# Altium schematic sheet Peripheral.SchDoc
size 381 x 241 mm; SheetNumber: 1; SheetTotal: 3
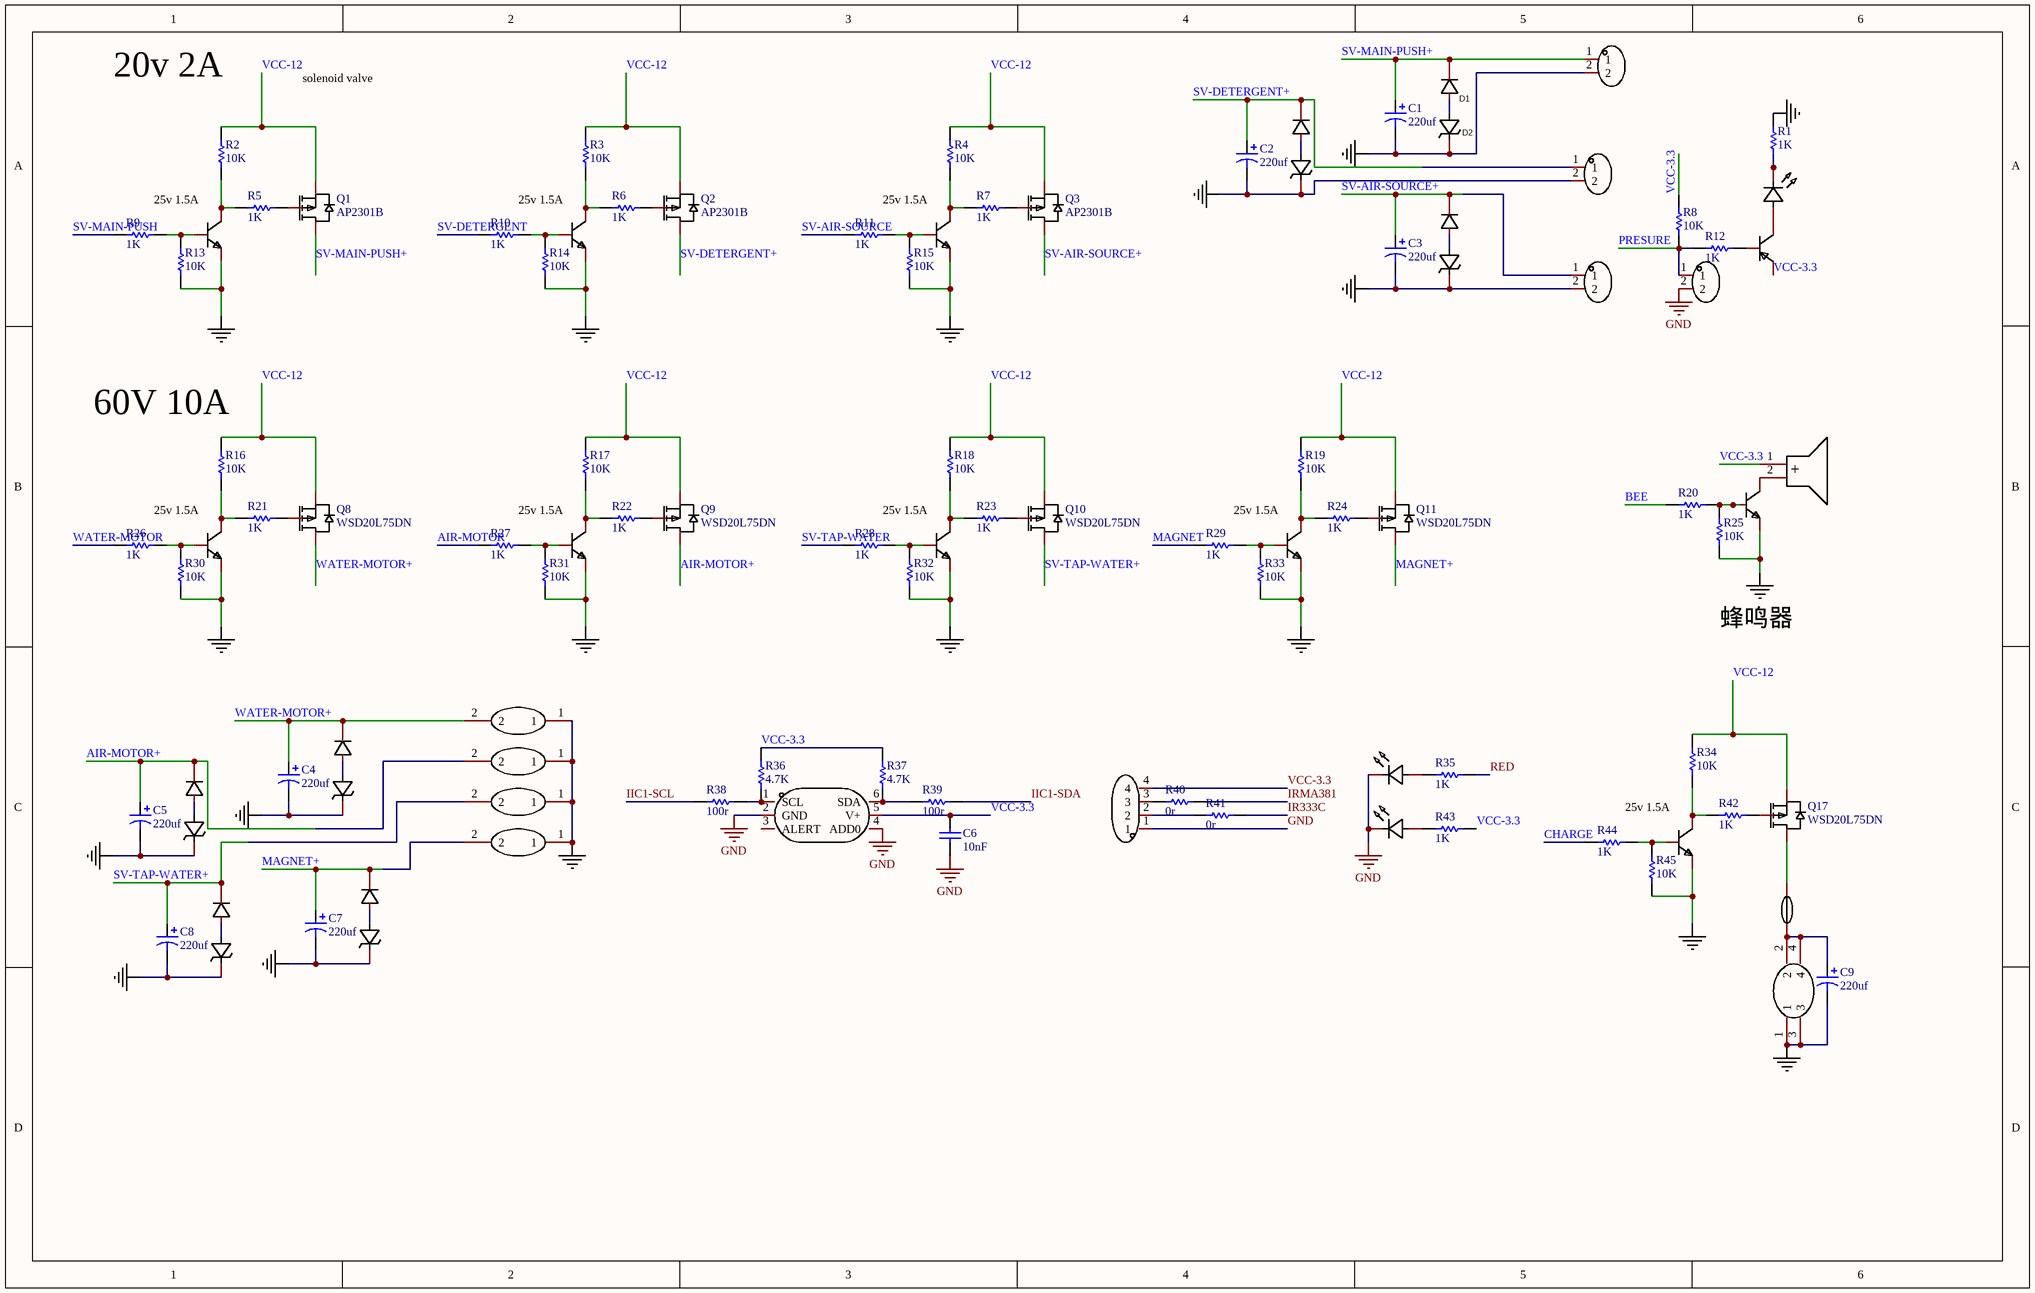
[diagram p0: Peripheral.SchDoc]

## Parts
B1  HNB09A03  [BUZ-TH_BD9.0-P5.00-D0.6-FD]  (value not drawn)
C1  value 220uf  [CAP-SMD_BD6.3-L6.6-W6.6-LS7.4-FD]  (hidden comment: RVT1E221M0607)
C2  value 220uf  [CAP-SMD_BD6.3-L6.6-W6.6-LS7.4-FD]  (hidden comment: RVT1E221M0607)
C3  value 220uf  [CAP-SMD_BD6.3-L6.6-W6.6-LS7.4-FD]  (hidden comment: RVT1E221M0607)
C4  value 220uf  [CAP-SMD_BD6.3-L6.6-W6.6-LS7.4-FD]  (hidden comment: RVT1E221M0607)
C5  value 220uf  [CAP-SMD_BD6.3-L6.6-W6.6-LS7.4-FD]  (hidden comment: RVT1E221M0607)
C6  value 10nF  [C0402]  (hidden comment: CL05B103KB5NNNC)
C7  value 220uf  [CAP-SMD_BD6.3-L6.6-W6.6-LS7.4-FD]  (hidden comment: RVT1E221M0607)
C8  value 220uf  [CAP-SMD_BD6.3-L6.6-W6.6-LS7.4-FD]  (hidden comment: RVT1E221M0607)
C9  value 220uf  [CAP-SMD_BD6.3-L6.6-W6.6-LS7.4-FD]  (hidden comment: RVT1E221M0607)
D1  SM4007PL  [SOD-123F_L2.8-W1.8-LS3.7-RD]  (value not drawn)
D2  BZT52C18W  [SOD-123_L2.7-W1.6-LS3.8-RD]  (value not drawn)
D3  SM4007PL  [SOD-123F_L2.8-W1.8-LS3.7-RD]  (value not drawn)
D4  BZT52C18W  [SOD-123_L2.7-W1.6-LS3.8-RD]  (value not drawn)
D5  SM4007PL  [SOD-123F_L2.8-W1.8-LS3.7-RD]  (value not drawn)
D6  BZT52C18W  [SOD-123_L2.7-W1.6-LS3.8-RD]  (value not drawn)
D7  SM4007PL  [SOD-123F_L2.8-W1.8-LS3.7-RD]  (value not drawn)
D8  BZT52C18W  [SOD-123_L2.7-W1.6-LS3.8-RD]  (value not drawn)
D9  KT-0603R  [LED0603-RD_RED]  (value not drawn)
D10  SM4007PL  [SOD-123F_L2.8-W1.8-LS3.7-RD]  (value not drawn)
D11  BZT52C18W  [SOD-123_L2.7-W1.6-LS3.8-RD]  (value not drawn)
D12  KT-0603W  [LED0603-RD_RED]  (value not drawn)
D13  SM4007PL  [SOD-123F_L2.8-W1.8-LS3.7-RD]  (value not drawn)
D14  SM4007PL  [SOD-123F_L2.8-W1.8-LS3.7-RD]  (value not drawn)
D15  BZT52C18W  [SOD-123_L2.7-W1.6-LS3.8-RD]  (value not drawn)
D16  BZT52C18W  [SOD-123_L2.7-W1.6-LS3.8-RD]  (value not drawn)
F1  BSMD2920-600-16V  [F2920]  (value not drawn)
LED1  19-213/Y2C-CQ2R2L/3T(CY)  [LED0603-RD_RED]  (value not drawn)
P1  ZX-HY2.0-2PZZ  [CONN-TH_2P-P2.00_ZX-HY2.0-2PZZ]  (value not drawn)
P2  ZX-HY2.0-2PZZ  [CONN-TH_2P-P2.00_ZX-HY2.0-2PZZ]  (value not drawn)
P3  ZX-HY2.0-2PZZ  [CONN-TH_2P-P2.00_ZX-HY2.0-2PZZ]  (value not drawn)
P4  ZX-HY2.0-2PZZ  [CONN-TH_2P-P2.00_ZX-HY2.0-2PZZ]  (value not drawn)
P5  HC-5557-2*1A  [CONN-TH_HAA420A-2A]  (value not drawn)
P6  HC-5557-2*1A  [CONN-TH_HAA420A-2A]  (value not drawn)
P7  HC-5557-2*1A  [CONN-TH_HAA420A-2A]  (value not drawn)
P8  ZX-HY2.0-4PZZ  [CONN-TH_4P-P2.00_HX20020-4A_2]  (value not drawn)
P9  HC-5557-2*1A  [CONN-TH_HAA420A-2A]  (value not drawn)
P10  HC-5557-2*2A  [CONN-TH_HAA420A-4A]  (value not drawn)
Q1  AP2301B  [SOT-23-3_L2.9-W1.3-P1.90-LS2.4-TR]
Q2  AP2301B  [SOT-23-3_L2.9-W1.3-P1.90-LS2.4-TR]
Q3  AP2301B  [SOT-23-3_L2.9-W1.3-P1.90-LS2.4-TR]
Q4  SS8050(RANGE:200-350)  [SOT-23_L2.9-W1.3-P1.90-LS2.4-BR]  (value not drawn)
Q5  SS8050(RANGE:200-350)  [SOT-23_L2.9-W1.3-P1.90-LS2.4-BR]  (value not drawn)
Q6  SS8050(RANGE:200-350)  [SOT-23_L2.9-W1.3-P1.90-LS2.4-BR]  (value not drawn)
Q7  SS8550 Y2(RANGE:200-350)  [SOT-23_L2.9-W1.3-P1.90-LS2.4-BR]  (value not drawn)
Q8  WSD20L75DN  [DFN-8_L3.3-W3.3-P0.65-BL_WSD20L75DN]
Q9  WSD20L75DN  [DFN-8_L3.3-W3.3-P0.65-BL_WSD20L75DN]
Q10  WSD20L75DN  [DFN-8_L3.3-W3.3-P0.65-BL_WSD20L75DN]
Q11  WSD20L75DN  [DFN-8_L3.3-W3.3-P0.65-BL_WSD20L75DN]
Q12  SS8050(RANGE:200-350)  [SOT-23_L2.9-W1.3-P1.90-LS2.4-BR]  (value not drawn)
Q13  SS8050(RANGE:200-350)  [SOT-23_L2.9-W1.3-P1.90-LS2.4-BR]  (value not drawn)
Q14  SS8050(RANGE:200-350)  [SOT-23_L2.9-W1.3-P1.90-LS2.4-BR]  (value not drawn)
Q15  SS8050(RANGE:200-350)  [SOT-23_L2.9-W1.3-P1.90-LS2.4-BR]  (value not drawn)
Q16  SS8050(RANGE:200-350)  [SOT-23_L2.9-W1.3-P1.90-LS2.4-BR]  (value not drawn)
Q17  WSD20L75DN  [DFN-8_L3.3-W3.3-P0.65-BL_WSD20L75DN]
Q18  SS8050(RANGE:200-350)  [SOT-23_L2.9-W1.3-P1.90-LS2.4-BR]  (value not drawn)
R1  value 1K  [R0402]  (hidden comment: 0402WGF1001TCE)
R2  value 10K  [R0402]  (hidden comment: 0402WGF1002TCE)
R3  value 10K  [R0402]  (hidden comment: 0402WGF1002TCE)
R4  value 10K  [R0402]  (hidden comment: 0402WGF1002TCE)
R5  value 1K  [R0402]  (hidden comment: 0402WGF1001TCE)
R6  value 1K  [R0402]  (hidden comment: 0402WGF1001TCE)
R7  value 1K  [R0402]  (hidden comment: 0402WGF1001TCE)
R8  value 10K  [R0402]  (hidden comment: 0402WGF1002TCE)
R9  value 1K  [R0402]  (hidden comment: 0402WGF1001TCE)
R10  value 1K  [R0402]  (hidden comment: 0402WGF1001TCE)
R11  value 1K  [R0402]  (hidden comment: 0402WGF1001TCE)
R12  value 1K  [R0402]  (hidden comment: 0402WGF1001TCE)
R13  value 10K  [R0402]  (hidden comment: 0402WGF1002TCE)
R14  value 10K  [R0402]  (hidden comment: 0402WGF1002TCE)
R15  value 10K  [R0402]  (hidden comment: 0402WGF1002TCE)
R16  value 10K  [R0402]  (hidden comment: 0402WGF1002TCE)
R17  value 10K  [R0402]  (hidden comment: 0402WGF1002TCE)
R18  value 10K  [R0402]  (hidden comment: 0402WGF1002TCE)
R19  value 10K  [R0402]  (hidden comment: 0402WGF1002TCE)
R20  value 1K  [R0402]  (hidden comment: 0402WGF1001TCE)
R21  value 1K  [R0402]  (hidden comment: 0402WGF1001TCE)
R22  value 1K  [R0402]  (hidden comment: 0402WGF1001TCE)
R23  value 1K  [R0402]  (hidden comment: 0402WGF1001TCE)
R24  value 1K  [R0402]  (hidden comment: 0402WGF1001TCE)
R25  value 10K  [R0402]  (hidden comment: 0402WGF1002TCE)
R26  value 1K  [R0402]  (hidden comment: 0402WGF1001TCE)
R27  value 1K  [R0402]  (hidden comment: 0402WGF1001TCE)
R28  value 1K  [R0402]  (hidden comment: 0402WGF1001TCE)
R29  value 1K  [R0402]  (hidden comment: 0402WGF1001TCE)
R30  value 10K  [R0402]  (hidden comment: 0402WGF1002TCE)
R31  value 10K  [R0402]  (hidden comment: 0402WGF1002TCE)
R32  value 10K  [R0402]  (hidden comment: 0402WGF1002TCE)
R33  value 10K  [R0402]  (hidden comment: 0402WGF1002TCE)
R34  value 10K  [R0402]  (hidden comment: 0402WGF1002TCE)
R35  value 1K  [R0402]  (hidden comment: 0402WGF1001TCE)
R36  value 4.7K  [R0402]  (hidden comment: 0402WGF4701TCE)
R37  value 4.7K  [R0402]  (hidden comment: 0402WGF4701TCE)
R38  value 100r  [R0402]  (hidden comment: 0402WGF1000TCE)
R39  value 100r  [R0402]  (hidden comment: 0402WGF1000TCE)
R40  value 0r  [R0402]  (hidden comment: 0402WGF0000TCE)
R41  value 0r  [R0402]  (hidden comment: 0402WGF0000TCE)
R42  value 1K  [R0402]  (hidden comment: 0402WGF1001TCE)
R43  value 1K  [R0402]  (hidden comment: 0402WGF1001TCE)
R44  value 1K  [R0402]  (hidden comment: 0402WGF1001TCE)
R45  value 10K  [R0402]  (hidden comment: 0402WGF1002TCE)
U1  TMP112AIDRLR  [SOT-563_L1.6-W1.2-P0.50-LS1.6-BR]  (value not drawn)

## Nets
GND: C1.2 C2.2 C3.2 C4.2 C5.2 C6.2 C7.2 C8.2 C9.2 D2.1(C) D4.1(C) D6.1(C) D8.1(C) D9.1(K) D11.1(C) D12.1(K) D15.1(C) D16.1(C) P1.2 P2.2 P3.2 P4.2 P5.1 P6.1 P7.1 P8.1 P9.1 P10.1 P10.3 Q4.2 Q5.2 Q6.2 Q12.2 Q13.2 Q14.2 Q15.2 Q16.2 Q18.2 R1.2 R13.1 R14.1 R15.1 R25.1 R30.1 R31.1 R32.1 R33.1 R45.1 U1.2(GND) U1.4(ADD0)
AIR-MOTOR: R27.1
AIR-MOTOR+: C5.1 D10.1(C) P6.2 Q9.3(D)
BEE: R20.1
CHARGE: R44.1
IIC1-SCL: R38.1
IIC1-SDA: R39.2
IR333C: R41.2
IRMA381: R40.2
MAGNET: R29.1
MAGNET+: C7.1 D13.1(C) P9.2 Q11.3(D)
PRESURE: P4.1 R8.1 R12.2
RED: R35.2
SV-AIR-SOURCE: R11.1
SV-AIR-SOURCE+: C3.1 D5.1(C) P3.1 Q3.3(D)
SV-DETERGENT: R10.1
SV-DETERGENT+: C2.1 D3.1(C) P2.1 Q2.3(D)
SV-MAIN-PUSH: R9.1
SV-MAIN-PUSH+: C1.1 D1.1(C) P1.1 Q1.3(D)
SV-TAP-WATER: R28.1
SV-TAP-WATER+: C8.1 D14.1(C) P7.2 Q10.3(D)
VCC-3.3: B1.1(+) C6.1 P8.4 Q7.2(E) R8.2 R36.2 R37.2 R43.2 U1.5(V+)
VCC-12: Q1.1(S) Q2.1(S) Q3.1(S) Q8.1(S) Q9.1(S) Q10.1(S) Q11.1(S) Q17.1(S) R2.2 R3.2 R4.2 R16.2 R17.2 R18.2 R19.2 R34.2
WATER-MOTOR: R26.1
WATER-MOTOR+: C4.1 D7.1(C) P5.2 Q8.3(D)
NetB1_2: B1.2(-) Q12.3
NetC9_1: C9.1 F1.1 P10.2 P10.4
NetD1_2: D1.2(A) D2.2(A)
NetD3_2: D3.2(A) D4.2(A)
NetD5_2: D5.2(A) D6.2(A)
NetD7_2: D7.2(A) D8.2(A)
NetD9_2: D9.2(A) R35.1
NetD10_2: D10.2(A) D11.2(A)
NetD12_2: D12.2(A) R43.1
NetD13_2: D13.2(A) D15.2(A)
NetD14_2: D14.2(A) D16.2(A)
NetF1_2: F1.2 Q17.3(D)
NetLED1_1: LED1.1(K) R1.1
NetLED1_2: LED1.2(A) Q7.3(C)
NetP8_2: P8.2 R41.1
NetP8_3: P8.3 R40.1
NetQ1_2: Q1.2(G) R5.2
NetQ2_2: Q2.2(G) R6.2
NetQ3_2: Q3.2(G) R7.2
NetQ4_1: Q4.1 R9.2 R13.2
NetQ4_3: Q4.3 R2.1 R5.1
NetQ5_1: Q5.1 R10.2 R14.2
NetQ5_3: Q5.3 R3.1 R6.1
NetQ6_1: Q6.1 R11.2 R15.2
NetQ6_3: Q6.3 R4.1 R7.1
NetQ7_1: Q7.1(B) R12.1
NetQ8_2: Q8.2(G) R21.2
NetQ9_2: Q9.2(G) R22.2
NetQ10_2: Q10.2(G) R23.2
NetQ11_2: Q11.2(G) R24.2
NetQ12_1: Q12.1 R20.2 R25.2
NetQ13_1: Q13.1 R26.2 R30.2
NetQ13_3: Q13.3 R16.1 R21.1
NetQ14_1: Q14.1 R27.2 R31.2
NetQ14_3: Q14.3 R17.1 R22.1
NetQ15_1: Q15.1 R28.2 R32.2
NetQ15_3: Q15.3 R18.1 R23.1
NetQ16_1: Q16.1 R29.2 R33.2
NetQ16_3: Q16.3 R19.1 R24.1
NetQ17_2: Q17.2(G) R42.2
NetQ18_1: Q18.1 R44.2 R45.2
NetQ18_3: Q18.3 R34.1 R42.1
NetR36_1: R36.1 R38.2 U1.1(SCL)
NetR37_1: R37.1 R39.1 U1.6(SDA)

Not connected (* = marked no-connect by the designer): U1 3(ALERT)

## Notes on the sheet
- 20v 2A
- solenoid valve
- (near Q4) 25v 1.5A
- (near Q5) 25v 1.5A
- (near Q6) 25v 1.5A
- (near R16) 60V 10A
- (near Q13) 25v 1.5A
- (near Q14) 25v 1.5A
- (near Q15) 25v 1.5A
- (near Q16) 25v 1.5A
- 蜂鸣器
- (near Q18) 25v 1.5A

## Library data of the parts
B1 = 蜂鸣器（有源）: Manufacturer: 华能; Name: 3kHz; Add into BOM: yes; Oscillator Circuit: 有源(内含驱动线路); Technology Type: 电磁式; Operating Voltage: 1.5V~4.5V; Value: 3kHz; Current Consumption: 30mA; Sound Pressure Level (SPL): 85dB@10cm; Symbol: HNB09A03; Device: HNB09A03; LCSC Part Name: 电磁式有源一体蜂鸣器HNB09A03; Supplier Part: C96102; Manufacturer Part: HNB09A03; Supplier Footprint: 插件,D=9mm; JLCPCB Part Class: Extended Part; Datasheet: https://atta.szlcsc.com/upload/public/pdf/source/20170522/1495448326172.pdf; Supplier: LCSC; Convert to PCB: yes; Diameter (φD): 9mm; Length: -; Width: -; Height: 5.5mm; Operating Temperature: -20℃~+70℃
C1-C5 C7-C9 = Cap电解电容: Polarized Capacitor (Axial); Published: 8-Jun-2000; LatestRevisionDate: 17-Jul-2002; LatestRevisionNote: Re-released for DXP Platform.; PackageReference: POLAR0.8; Publisher: Altium Limited; PackageDescription: Polarized Capacitor; 2 Leads
C6 = 10nf: Capacitor; Published: 8-Jun-2000; LatestRevisionDate: 17-Jul-2002; LatestRevisionNote: Re-released for DXP Platform.; PackageReference: 0402; Publisher: Altium Limited; PackageDescription: Radial Cap, Thru-Hole; 2 Leads; 0.3 in Pin Spacing
D1 D3 D5 D7 D10 D13 D14 = Diode ordinary: 普通二极管 1kv1A; Manufacturer: MDD(辰达半导体); Device: SM4007PL_C64898; Add into BOM: yes; Diode Configuration: 独立式; Forward Voltage (Vf@If): 1.1V@1A; Reverse Voltage (Vr): 1kV; Rectified Current: 1A; Reverse Leakage Current: 10uA@1kV; Name: SM4007PL; Symbol: SM4007PL; LCSC Part Name: 电压:1kV 电流:1A; Supplier Part: C64898; Manufacturer Part: SM4007PL; Supplier Footprint: SOD-123FL; JLCPCB Part Class: Basic Part; Datasheet: https://atta.szlcsc.com/upload/public/pdf/source/20230823/16A8FDE162764C9B685A3717F2DA3690.pdf; Supplier: LCSC; Convert to PCB: yes
D2 D4 D6 D8 D11 D15 D16 = Diode 18v Zener: 稳压二极管18v 5mA（击穿以后还能恢复）; Manufacturer: CBI(创基); Add into BOM: yes; Diode Configuration: 独立式; Zener Voltage (Nom): 18V; Reverse Leakage Current (Ir): 100nA@12.6V; Zener Voltage (Range): 16.8V~19.1V; Power Dissipation: 500mW; Zener Impedance (Zzt): 45Ω; Name: BZT52C18W; Symbol: BZT52C18W; Device: BZT52C18W; LCSC Part Name: BZT52C18W; Supplier Part: C2832635; Manufacturer Part: BZT52C18W; Supplier Footprint: SOD-123; JLCPCB Part Class: Extended Part; Datasheet: https://atta.szlcsc.com/upload/public/pdf/source/20210520/C2832619_E5A43A150FDB3A0AFB79B689AFD0C305.pdf; Supplier: LCSC; Convert to PCB: yes
D9 = led_R: 红 0603 2.3v; Manufacturer: XINGLIGHT(成兴光); Name: XL-1608SURC-06; Add into BOM: yes; Emitted Color: 红色; Power Dissipation: 55mW; Forward Current: 25mA; Dominant Wavelength: 617nm~621nm; Peak Wavelength: 623nm; Lens Color: 无色透明透镜; Viewing Angle: 120°; Mounting Sytle: 正贴; Symbol: XL-1608SURC-06; Device: XL-1608SURC-06; LCSC Part Name: XL-1608SURC-06; Supplier Part: C965799; Manufacturer Part: XL-1608SURC-06; Supplier Footprint: 0603; JLCPCB Part Class: Extended Part; Datasheet: https://atta.szlcsc.com/upload/public/pdf/source/20221102/D860AFDD1CDB02C5A8064103A32707E2.pdf; Supplier: LCSC; Convert to PCB: yes; Color Temperature: -; Operating Temperature: -30℃~+85℃
D12 = led_w: 白 0603 2.3v; Manufacturer: XINGLIGHT(成兴光); Name: XL-1608SURC-06; Add into BOM: yes; Emitted Color: 红色; Power Dissipation: 55mW; Forward Current: 25mA; Dominant Wavelength: 617nm~621nm; Peak Wavelength: 623nm; Lens Color: 无色透明透镜; Viewing Angle: 120°; Mounting Sytle: 正贴; Symbol: XL-1608SURC-06; Device: XL-1608SURC-06; LCSC Part Name: XL-1608SURC-06; Supplier Part: C965799; Manufacturer Part: XL-1608SURC-06; Supplier Footprint: 0603; JLCPCB Part Class: Extended Part; Datasheet: https://atta.szlcsc.com/upload/public/pdf/source/20221102/D860AFDD1CDB02C5A8064103A32707E2.pdf; Supplier: LCSC; Convert to PCB: yes; Color Temperature: -; Operating Temperature: -30℃~+85℃
F1 = 保险丝: 自恢复保险丝 6A 16V; Manufacturer: BHFUSE(佰宏); Add into BOM: yes; Current Rating (Max): 40A; Trip Current: 12A; Power Dissipation: 2W; Resistance - Initial (Ri) (Min): 4mΩ; Resistance - Post Trip (R1) (Max): 20mΩ; Maximum Time to Trip: 6s; Name: BSMD2920-600-16V; Symbol: BSMD2920-600-16V; Device: BSMD2920-600-16V; LCSC Part Name: 2920 6A 16V 佰宏大电流; Supplier Part: C910847; Manufacturer Part: BSMD2920-600-16V; Supplier Footprint: 2920; JLCPCB Part Class: Extended Part; Datasheet: https://atta.szlcsc.com/upload/public/pdf/source/20230512/D022CCFE0A7F15633C929F419B252442.pdf; Supplier: LCSC; Convert to PCB: yes; Operating Voltage (Max): 16V; Hold Current: 6A; Operating Temperature: -40℃~+85℃
LED1 = led_y: 黄 0603 2.3v; Manufacturer: XINGLIGHT(成兴光); Name: XL-1608SURC-06; Add into BOM: yes; Emitted Color: 红色; Power Dissipation: 55mW; Forward Current: 25mA; Dominant Wavelength: 617nm~621nm; Peak Wavelength: 623nm; Lens Color: 无色透明透镜; Viewing Angle: 120°; Mounting Sytle: 正贴; Symbol: XL-1608SURC-06; Device: XL-1608SURC-06; LCSC Part Name: XL-1608SURC-06; Supplier Part: C965799; Manufacturer Part: XL-1608SURC-06; Supplier Footprint: 0603; JLCPCB Part Class: Extended Part; Datasheet: https://atta.szlcsc.com/upload/public/pdf/source/20221102/D860AFDD1CDB02C5A8064103A32707E2.pdf; Supplier: LCSC; Convert to PCB: yes; Color Temperature: -; Operating Temperature: -30℃~+85℃
P1-P4 = HY2.0-2PZZ: 2p; Manufacturer: Megastar(兆星); Add into BOM: yes; Pins Structure: 1x2P; Pitch: 2mm; Reference Series: HY; Number of PINs Per Row: 2; Current Rating (Max): 2A; Name: ZX-HY2.0-2PZZ; Symbol: ZX-HY2.0-2PZZ; Device: ZX-HY2.0-2PZZ; LCSC Part Name: 1x2P 间距:2mm 直插 系列:HY; Supplier Part: C7429578; Manufacturer Part: ZX-HY2.0-2PZZ; Supplier Footprint: 插件,P=2mm; JLCPCB Part Class: Extended Part; Datasheet: https://atta.szlcsc.com/upload/public/pdf/source/20230619/DEC43A5E9BAFB7A5BDB16FEDBE15E2A0.pdf; Supplier: LCSC; Convert to PCB: yes; Mounting Style: 直插; Number of Pins: 2P; Number of Rows: 1; Row Spacing: -; Contact Material: 黄铜; Contact Plating: 锡; Operating Temperature Range: -25℃~+85℃
P5-P7 P9 = HC-5557-2*1A: 2p; Manufacturer: HCTL(华灿天禄); Add into BOM: yes; Pins Structure: 2x1P; Pitch: 4.2mm; Number of PINs Per Row: 1; Current Rating (Max): 9A; Name: HC-5557-2*1A; Symbol: HC-5557-2*1A; Device: HC-5557-2*1A; LCSC Part Name: 2x1P 间距:4.2mm 直插; Supplier Part: C2845776; Manufacturer Part: HC-5557-2*1A; Supplier Footprint: 插件,P=4.2mm; JLCPCB Part Class: Extended Part; Datasheet: https://atta.szlcsc.com/upload/public/pdf/source/20230620/FF5B1F4AE343F4430EEB0EA0134778E8.pdf; Supplier: LCSC; Convert to PCB: yes; Mounting Style: 直插; Reference Series: -; Number of Pins: 2P; Number of Rows: 2; Row Spacing: 4.2mm; Contact Material: 黄铜; Contact Plating: 锡; Operating Temperature Range: -25℃~+85℃
P8 = HY2.0-4PZZ: 4p; Manufacturer: Megastar(兆星); Add into BOM: yes; Pins Structure: 1x4P; Pitch: 2mm; Reference Series: HY; Number of PINs Per Row: 4; Current Rating (Max): 2A; Name: ZX-HY2.0-4PZZ; Symbol: ZX-HY2.0-4PZZ; Device: ZX-HY2.0-4PZZ; LCSC Part Name: 1x4P 间距:2mm 直插 系列:HY; Supplier Part: C7429580; Manufacturer Part: ZX-HY2.0-4PZZ; Supplier Footprint: 插件,P=2mm; JLCPCB Part Class: Extended Part; Datasheet: https://atta.szlcsc.com/upload/public/pdf/source/20230619/44026E9B0BFE007E57437F997C730D91.pdf; Supplier: LCSC; Convert to PCB: yes; Mounting Style: 直插; Number of Pins: 4P; Number of Rows: 1; Row Spacing: -; Contact Material: 黄铜; Contact Plating: 锡; Operating Temperature Range: -25℃~+85℃
P10 = HC-5557-2*2A: 4p; Manufacturer: HCTL(华灿天禄); Add into BOM: yes; Pins Structure: 2x2P; Pitch: 4.2mm; Number of PINs Per Row: 2; Current Rating (Max): 9A; Name: HC-5557-2*2A; Symbol: HC-5557-2*2A; Device: HC-5557-2*2A; LCSC Part Name: 2x2P 间距:4.2mm 直插; Supplier Part: C2845777; Manufacturer Part: HC-5557-2*2A; Supplier Footprint: 插件,P=4.2mm; JLCPCB Part Class: Extended Part; Datasheet: https://atta.szlcsc.com/upload/public/pdf/source/20230620/FF5B1F4AE343F4430EEB0EA0134778E8.pdf; Supplier: LCSC; Convert to PCB: yes; Mounting Style: 直插; Reference Series: -; Number of Pins: 4P; Number of Rows: 2; Row Spacing: 4.2mm; Contact Material: 黄铜; Contact Plating: 锡; Operating Temperature Range: -25℃~+85℃
Q1-Q3 = NPN_MOS: 20V 2A; Manufacturer: ALLPOWER(铨力); Add into BOM: yes; Type: P沟道; Power Dissipation (Pd): 750mW; Drain Source On Resistance (RDS(on)@Vgs,Id): 130mΩ@4.5V,2A; Gate Threshold Voltage (Vgs(th)@Id): 950mV@250uA; Input Capacitance (Ciss@Vds): 210pF@6V; Reverse Transfer Capacitance (Crss@Vds): 27pF@6V; Symbol: AP2301B; Device: AP2301B; LCSC Part Name: P沟道 耐压:20V 电流:2A; Supplier Part: C2763847; Manufacturer Part: AP2301B; Supplier Footprint: SOT-23; JLCPCB Part Class: 扩展库; Datasheet: https://atta.szlcsc.com/upload/public/pdf/source/20210401/C2763847_842F2A0FFE6F1F01F619022F78C12F29.pdf; Supplier: LCSC; Convert to PCB: yes; Drain Source Voltage (Vdss): 20V; Continuous Drain Current (Id): 2A; Total Gate Charge (Qg@Vgs): -; Name: AP2301B
Q4-Q6 Q12-Q16 Q18 = npn_triode: NPN三极管 高电平导通; Manufacturer: Nexperia(安世); Name: PMBT3904,215; Add into BOM: yes; Transistor Type: NPN; Collector Current (Ic): 200mA; Collector-Emitter Breakdown Voltage (Vceo): 40V; Power Dissipation (Pd): 250mW; DC Current Gain (hFE@Ic,Vce): 100@10mA,1V; Transition Frequency (fT): 300MHz; Collector Cut-Off Current (Icbo): 50nA; Collector-Emitter Saturation Voltage (VCE(sat)@Ic,Ib): 300mV@50mA,5mA; Symbol: PMBT3904,215; Device: PMBT3904,215; LCSC Part Name: NPN 电流:200mA 耐压:40V; Supplier Part: C8667; Manufacturer Part: PMBT3904,215; Supplier Footprint: SOT-23; JLCPCB Part Class: Extended Part; Datasheet: https://atta.szlcsc.com/upload/public/pdf/source/20210520/C8667_82CC4B18F957EC74ED6E8B4E120941E6.pdf; Supplier: LCSC; Convert to PCB: yes; Operating Temperature: -
Q7 = pnp_triode: PNP三极管 低电平导通; Manufacturer: CJ(江苏长电/长晶); Symbol: SS8550_C8542; Add into BOM: yes; Transistor Type: PNP; Collector Current (Ic): 1.5A; Collector-Emitter Breakdown Voltage (Vceo): 25V; Power Dissipation (Pd): 300mW; DC Current Gain (hFE@Ic,Vce): 200@100mA,1V; Transition Frequency (fT): 100MHz; Collector Cut-Off Current (Icbo): 100nA; Collector-Emitter Saturation Voltage (VCE(sat)@Ic,Ib): 500mV@800mA,80mA; Name: SS8550 Y2; Device: SS8550 Y2; LCSC Part Name: SS8550 Y2(RANGE:200-350) hfe=200~350; Supplier Part: C8542; Manufacturer Part: SS8550 Y2; Supplier Footprint: SOT-23; JLCPCB Part Class: Basic Part; Datasheet: https://atta.szlcsc.com/upload/public/pdf/source/20140809/1457707214734.pdf; Supplier: LCSC; Convert to PCB: yes; Operating Temperature: -
Q8-Q11 Q17 = NPN_MOS: 20V 2A; Manufacturer: ALLPOWER(铨力); Symbol: AP2301B; Add into BOM: yes; Type: P沟道; Power Dissipation (Pd): 750mW; Drain Source On Resistance (RDS(on)@Vgs,Id): 130mΩ@4.5V,2A; Gate Threshold Voltage (Vgs(th)@Id): 950mV@250uA; Input Capacitance (Ciss@Vds): 210pF@6V; Reverse Transfer Capacitance (Crss@Vds): 27pF@6V; Device: AP2301B; LCSC Part Name: P沟道 耐压:20V 电流:2A; Supplier Part: C2763847; Manufacturer Part: AP2301B; Supplier Footprint: SOT-23; JLCPCB Part Class: 扩展库; Datasheet: https://atta.szlcsc.com/upload/public/pdf/source/20210401/C2763847_842F2A0FFE6F1F01F619022F78C12F29.pdf; Supplier: LCSC; Convert to PCB: yes; Drain Source Voltage (Vdss): 20V; Continuous Drain Current (Id): 2A; Total Gate Charge (Qg@Vgs): -; Name: WSD20L75DN
R1 R5-R7 R9-R12 R20-R24 R26-R29 R35 R42-R44 = 1k: Semiconductor Resistor; Published: 8-Jun-2000; LatestRevisionDate: 17-Jul-2002; LatestRevisionNote: Re-released for DXP Platform.; PackageReference: 0402; Publisher: Altium Limited; PackageDescription: Axial Device, Thru-Hole; 2 Leads; 0.5 in Pin Spacing
R2-R4 R8 R13-R19 R25 R30-R34 R45 = 10K: Semiconductor Resistor; Published: 8-Jun-2000; LatestRevisionDate: 17-Jul-2002; LatestRevisionNote: Re-released for DXP Platform.; PackageReference: 0402; Publisher: Altium Limited; PackageDescription: Axial Device, Thru-Hole; 2 Leads; 0.5 in Pin Spacing
R36 R37 = 4.7k: Semiconductor Resistor; Published: 8-Jun-2000; LatestRevisionDate: 17-Jul-2002; LatestRevisionNote: Re-released for DXP Platform.; PackageReference: 0402; Publisher: Altium Limited; PackageDescription: Axial Device, Thru-Hole; 2 Leads; 0.5 in Pin Spacing
R38 R39 = 100r: Published: 8-Jun-2000; LatestRevisionDate: 17-Jul-2002; LatestRevisionNote: Re-released for DXP Platform.; PackageReference: 0402; Publisher: Altium Limited; PackageDescription: Axial Device, Thru-Hole; 2 Leads; 0.5 in Pin Spacing
R40 R41 = 0r: Published: 8-Jun-2000; LatestRevisionDate: 17-Jul-2002; LatestRevisionNote: Re-released for DXP Platform.; PackageReference: 0402; Publisher: Altium Limited; PackageDescription: Axial Device, Thru-Hole; 2 Leads; 0.5 in Pin Spacing
U1 = TMP112AIDRLR: 温度传感器; Manufacturer: UMW(友台半导体); Symbol: TMP112AIDRLR_C3019122; Add into BOM: yes; Supply Voltage: 1.4V~5.5V; Name: TMP112AIDRLR; Device: TMP112AIDRLR_C3019122; LCSC Part Name: TMP112AIDRLR; Supplier Part: C3019122; Manufacturer Part: TMP112AIDRLR; Supplier Footprint: SOT-563; JLCPCB Part Class: Extended Part; Datasheet: https://atta.szlcsc.com/upload/public/pdf/source/20231109/A719DECFDE63E3CAFA3142F9A44FF492.pdf; Supplier: LCSC; Convert to PCB: yes